# Altium project AfternoonCape_RevA1_TImux.PrjPCB
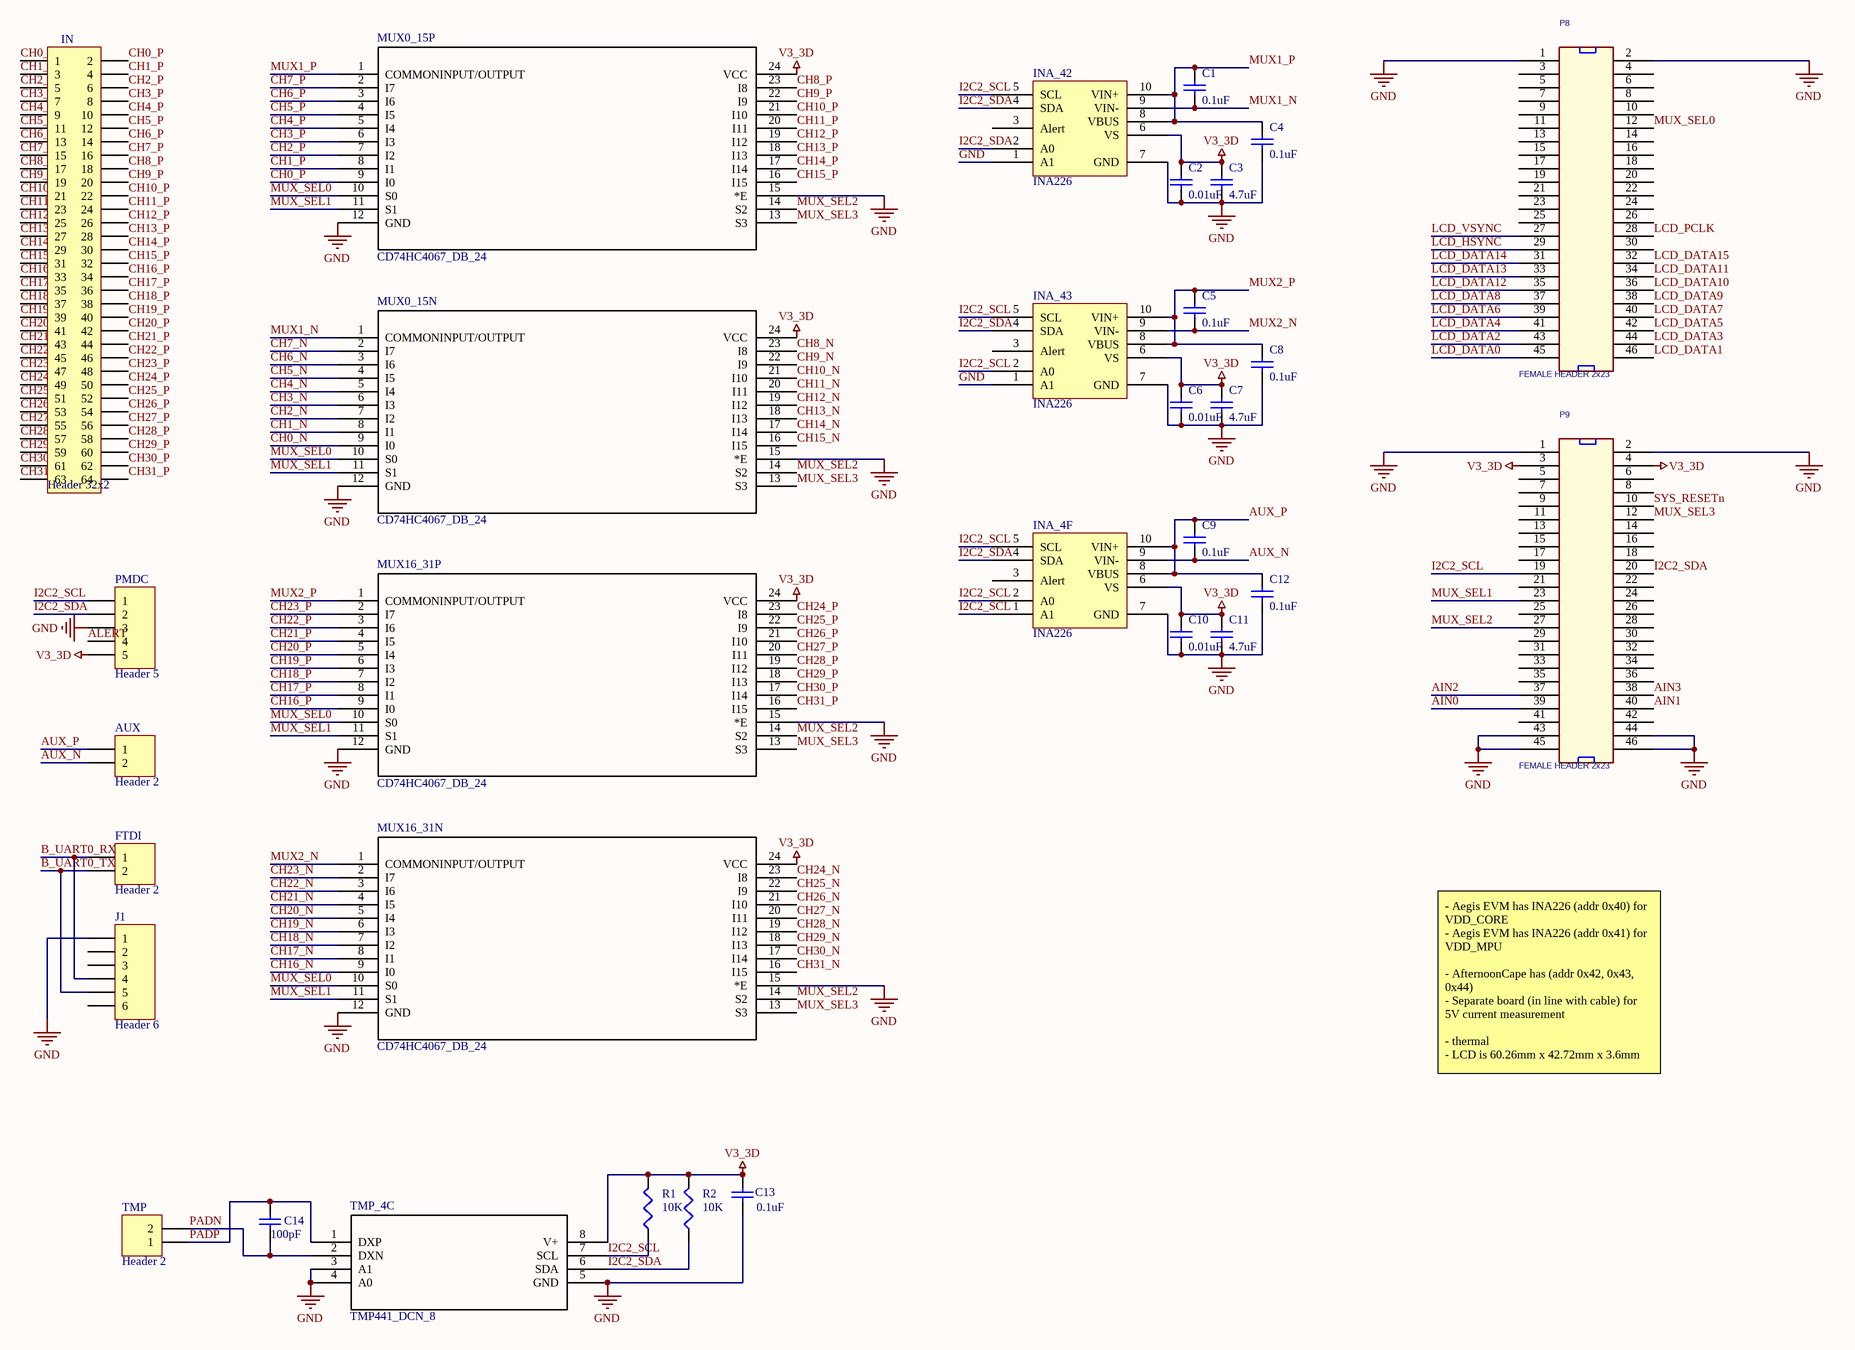
[diagram p0: AfternoonCape_RevA1_TImux.SchDoc]
1 sheet, 32 parts. Net scope: global (net labels, ports and power ports of the same name join across sheets).
Board file: AfternoonCape_RevA1_TImux.PcbDoc

## Sheet AfternoonCape_RevA1_TImux.SchDoc
size A2

### Parts
AUX  Header 2  [HDR1X2]
C1  value 0.1uF  [0402]  (hidden comment: Cap Semi)
C2  value 0.01uF  [0402]  (hidden comment: Cap Semi)
C3  value 4.7uF  [0402]  (hidden comment: Cap Semi)
C4  value 0.1uF  [0402]  (hidden comment: Cap Semi)
C5  value 0.1uF  [0402]  (hidden comment: Cap Semi)
C6  value 0.01uF  [0402]  (hidden comment: Cap Semi)
C7  value 4.7uF  [0402]  (hidden comment: Cap Semi)
C8  value 0.1uF  [0402]  (hidden comment: Cap Semi)
C9  value 0.1uF  [0402]  (hidden comment: Cap Semi)
C10  value 0.01uF  [0402]  (hidden comment: Cap Semi)
C11  value 4.7uF  [0402]  (hidden comment: Cap Semi)
C12  value 0.1uF  [0402]  (hidden comment: Cap Semi)
C13  value 0.1uF  [0402]  (hidden comment: Cap Semi)
C14  value 100pF  [0402]  (hidden comment: Cap Semi)
FTDI  Header 2  [HDR1X2]
IN  Header 32x2  [HDR2x32]
INA_4F  INA226  [DGS10]
INA_42  INA226  [DGS10]
INA_43  INA226  [DGS10]
J1  Header 6  [HDR1X6]
MUX0_15N  CD74HC4067_DB_24  [DB24]
MUX0_15P  CD74HC4067_DB_24  [DB24]
MUX16_31N  CD74HC4067_DB_24  [DB24]
MUX16_31P  CD74HC4067_DB_24  [DB24]
P8  FEMALE HEADER 2x23  [HEADER23X2]
P9  FEMALE HEADER 2x23  [HEADER23X2]
PMDC  Header 5  [HDR1X5]
R1  value 10K  [0402]  (hidden comment: Res3)
R2  value 10K  [0402]  (hidden comment: Res3)
TMP  Header 2  [HDR1X2]
TMP_4C  TMP441_DCN_8  [DCN8-L]

### Nets
GND: C2.1 C3.1 C4.1 C6.1 C7.1 C8.1 C10.1 C11.1 C12.1 C13.1 INA_4F.7(GND) INA_42.1(A1) INA_42.7(GND) INA_43.1(A1) INA_43.7(GND) J1.1 MUX0_15N.12(GND) MUX0_15N.15(*E) MUX0_15P.12(GND) MUX0_15P.15(*E) MUX16_31N.12(GND) MUX16_31N.15(*E) MUX16_31P.12(GND) MUX16_31P.15(*E) P8.1 P8.2 P9.1 P9.2 P9.43 P9.44 P9.45 P9.46 PMDC.3 TMP_4C.3(A1) TMP_4C.4(A0) TMP_4C.5(GND)
V3_3D: C2.2 C3.2 C6.2 C7.2 C10.2 C11.2 C13.2 INA_4F.6(VS) INA_42.6(VS) INA_43.6(VS) MUX0_15N.24(VCC) MUX0_15P.24(VCC) MUX16_31N.24(VCC) MUX16_31P.24(VCC) P9.3 P9.4 PMDC.5 R1.2 R2.2 TMP_4C.8(V+)
AIN0: P9.39
AIN1: P9.40
AIN2: P9.37
AIN3: P9.38
ALERT: PMDC.4
AUX_N: AUX.2 C9.1 INA_4F.9(VIN-)
AUX_P: AUX.1 C9.2 C12.2 INA_4F.8(VBUS) INA_4F.10(VIN+)
B_UART0_RX: FTDI.1 J1.4
B_UART0_TX: FTDI.2 J1.5
CH0_N: IN.1 MUX0_15N.9(I0)
CH0_P: IN.2 MUX0_15P.9(I0)
CH1_N: IN.3 MUX0_15N.8(I1)
CH1_P: IN.4 MUX0_15P.8(I1)
CH2_N: IN.5 MUX0_15N.7(I2)
CH2_P: IN.6 MUX0_15P.7(I2)
CH3_N: IN.7 MUX0_15N.6(I3)
CH3_P: IN.8 MUX0_15P.6(I3)
CH4_N: IN.9 MUX0_15N.5(I4)
CH4_P: IN.10 MUX0_15P.5(I4)
CH5_N: IN.11 MUX0_15N.4(I5)
CH5_P: IN.12 MUX0_15P.4(I5)
CH6_N: IN.13 MUX0_15N.3(I6)
CH6_P: IN.14 MUX0_15P.3(I6)
CH7_N: IN.15 MUX0_15N.2(I7)
CH7_P: IN.16 MUX0_15P.2(I7)
CH8_N: IN.17 MUX0_15N.23(I8)
CH8_P: IN.18 MUX0_15P.23(I8)
CH9_N: IN.19 MUX0_15N.22(I9)
CH9_P: IN.20 MUX0_15P.22(I9)
CH10_N: IN.21 MUX0_15N.21(I10)
CH10_P: IN.22 MUX0_15P.21(I10)
CH11_N: IN.23 MUX0_15N.20(I11)
CH11_P: IN.24 MUX0_15P.20(I11)
CH12_N: IN.25 MUX0_15N.19(I12)
CH12_P: IN.26 MUX0_15P.19(I12)
CH13_N: IN.27 MUX0_15N.18(I13)
CH13_P: IN.28 MUX0_15P.18(I13)
CH14_N: IN.29 MUX0_15N.17(I14)
CH14_P: IN.30 MUX0_15P.17(I14)
CH15_N: IN.31 MUX0_15N.16(I15)
CH15_P: IN.32 MUX0_15P.16(I15)
CH16_N: IN.33 MUX16_31N.9(I0)
CH16_P: IN.34 MUX16_31P.9(I0)
CH17_N: IN.35 MUX16_31N.8(I1)
CH17_P: IN.36 MUX16_31P.8(I1)
CH18_N: IN.37 MUX16_31N.7(I2)
CH18_P: IN.38 MUX16_31P.7(I2)
CH19_N: IN.39 MUX16_31N.6(I3)
CH19_P: IN.40 MUX16_31P.6(I3)
CH20_N: IN.41 MUX16_31N.5(I4)
CH20_P: IN.42 MUX16_31P.5(I4)
CH21_N: IN.43 MUX16_31N.4(I5)
CH21_P: IN.44 MUX16_31P.4(I5)
CH22_N: IN.45 MUX16_31N.3(I6)
CH22_P: IN.46 MUX16_31P.3(I6)
CH23_N: IN.47 MUX16_31N.2(I7)
CH23_P: IN.48 MUX16_31P.2(I7)
CH24_N: IN.49 MUX16_31N.23(I8)
CH24_P: IN.50 MUX16_31P.23(I8)
CH25_N: IN.51 MUX16_31N.22(I9)
CH25_P: IN.52 MUX16_31P.22(I9)
CH26_N: IN.53 MUX16_31N.21(I10)
CH26_P: IN.54 MUX16_31P.21(I10)
CH27_N: IN.55 MUX16_31N.20(I11)
CH27_P: IN.56 MUX16_31P.20(I11)
CH28_N: IN.57 MUX16_31N.19(I12)
CH28_P: IN.58 MUX16_31P.19(I12)
CH29_N: IN.59 MUX16_31N.18(I13)
CH29_P: IN.60 MUX16_31P.18(I13)
CH30_N: IN.61 MUX16_31N.17(I14)
CH30_P: IN.62 MUX16_31P.17(I14)
CH31_N: IN.63 MUX16_31N.16(I15)
CH31_P: IN.64 MUX16_31P.16(I15)
I2C2_SCL: INA_4F.1(A1) INA_4F.2(A0) INA_4F.5(SCL) INA_42.5(SCL) INA_43.2(A0) INA_43.5(SCL) P9.19 PMDC.1 R1.1 TMP_4C.7(SCL)
I2C2_SDA: INA_4F.4(SDA) INA_42.2(A0) INA_42.4(SDA) INA_43.4(SDA) P9.20 PMDC.2 R2.1 TMP_4C.6(SDA)
LCD_DATA0: P8.45
LCD_DATA1: P8.46
LCD_DATA2: P8.43
LCD_DATA3: P8.44
LCD_DATA4: P8.41
LCD_DATA5: P8.42
LCD_DATA6: P8.39
LCD_DATA7: P8.40
LCD_DATA8: P8.37
LCD_DATA9: P8.38
LCD_DATA10: P8.36
LCD_DATA11: P8.34
LCD_DATA12: P8.35
LCD_DATA13: P8.33
LCD_DATA14: P8.31
LCD_DATA15: P8.32
LCD_HSYNC: P8.29
LCD_PCLK: P8.28
LCD_VSYNC: P8.27
MUX1_N: C1.1 INA_42.9(VIN-) MUX0_15N.1(COMMONINPUT/OUTPUT)
MUX1_P: C1.2 C4.2 INA_42.8(VBUS) INA_42.10(VIN+) MUX0_15P.1(COMMONINPUT/OUTPUT)
MUX2_N: C5.1 INA_43.9(VIN-) MUX16_31N.1(COMMONINPUT/OUTPUT)
MUX2_P: C5.2 C8.2 INA_43.8(VBUS) INA_43.10(VIN+) MUX16_31P.1(COMMONINPUT/OUTPUT)
MUX_SEL0: MUX0_15N.10(S0) MUX0_15P.10(S0) MUX16_31N.10(S0) MUX16_31P.10(S0) P8.12
MUX_SEL1: MUX0_15N.11(S1) MUX0_15P.11(S1) MUX16_31N.11(S1) MUX16_31P.11(S1) P9.23
MUX_SEL2: MUX0_15N.14(S2) MUX0_15P.14(S2) MUX16_31N.14(S2) MUX16_31P.14(S2) P9.27
MUX_SEL3: MUX0_15N.13(S3) MUX0_15P.13(S3) MUX16_31N.13(S3) MUX16_31P.13(S3) P9.12
PADN: C14.1 TMP.2 TMP_4C.2(DXN)
PADP: C14.2 TMP.1 TMP_4C.1(DXP)
SYS_RESETn: P9.10

Not connected (* = marked no-connect by the designer): INA_4F 3(Alert); INA_42 3(Alert); INA_43 3(Alert); J1 2 3 6; P8 3(2) 4(27) 5(3) 6(28) 7(4) 8(29) 9(5) 10(30) 11(6) 13(7) 14(32) 15(8) 16(33) 17(9) 18(34) 19(10) 20(35) 21(11) 22(36) 23(12) 24(37) 25(13) 26(38) 30(40); P9 5(3) 6(28) 7(4) 8(29) 9(5) 11(6) 13(7) 14(32) 15(8) 16(33) 17(9) 18(34) 21(11) 22(36) 24(37) 25(13) 26(38) 28(39) 29(15) 30(40) 31(16) 32(41) 33(17) 34(42) 35(18) 36(43) 41(21) 42(46)

### Notes on the sheet
- - Aegis EVM has INA226 (addr 0x40) for VDD_CORE
  - Aegis EVM has INA226 (addr 0x41) for VDD_MPU
  - AfternoonCape has (addr 0x42, 0x43, 0x44)
  - Separate board (in line with cable) for 5V current measurement
  - thermal
  - LCD is 60.26mm x 42.72mm x 3.6mm
- Title
- Size:
- Date:
- File:
- A2
- Number:
- Time:
- Revision:
- Sheet
- of

### Library data of the parts
AUX FTDI TMP = Header 2: Header, 2-Pin; LatestRevisionDate: 17-Jul-2002; LatestRevisionNote: Re-released for DXP Platform.; Publisher: Altium Limited
C1-C14 = Cap Semi: Capacitor (Semiconductor SIM Model); Published: 8-Jun-2000; LatestRevisionDate: 29-May-2009; LatestRevisionNote: IPC-7351 Footprint Added.; PackageReference: C1206; Publisher: Altium Limited; PackageDescription: Chip Capacitor
IN = Header 32x2: Header, 32-Pin, Dual row
J1 = Header 6: 6-pin female header, long legs for FTDI-USB cable; LatestRevisionDate: 17-Jul-2002; LatestRevisionNote: Re-released for DXP Platform.; Publisher: Altium Limited
MUX0_15N MUX0_15P MUX16_31N MUX16_31P = CD74HC4067_DB_24: Imported; Manufacturer: Texas Instruments; INDUSTRY_STD_PKG_TYPE: SSOP; FAMILY_NAME: ANALOG SWITCH/MULTIPLEXER(less than or equal to 5V); PIN_COUNT: 24; PACKAGE_DESIGNATOR: DB; Datasheet URL: http://www.ti.com/lit/gpn/CD74HC4067; GENERIC_PART_NUMBER: CD74HC4067; RefDes: RefDes; Type: DEV; Value: Value
P8 P9 = HDR_46_F_2_0.1_0.1: CONN HEADER FMAL 46PS.1" DL GOLD; Manufacturer: Sullins Connector Solutions; Manufacturer Part Number: PPPC232LFBN-RC; Number of Positions: 46; Number of Positions Loaded: All; Pitch: 0.100" (2.54mm); Supplier 1: Digi-Key; Supplier Part Number 1: S7126-ND; RoHS: RoHS Compliant; Category: Connectors, Interconnects; Stock 1: 750; Pricing 1: 1=2.75, 10=2.325, 25=2.2196, 50=2.0084, 100=1.7969, 250=1.58552, 500=1.4798, 1000=1.3741, 2500=1.32125 (USD); Connector Type: Header; Contact Type: Female Socket; Number of Rows: 2; Row Spacing: 0.100" (2.54mm); Mounting Type: Through Hole; Termination: Solder; Fastening Type: -; Features: -; Contact Finish: Gold; Contact Finish Thickness: Flash; Color: Black; Packaging: Bulk; ComponentLink1URL: http://www.sullinscorp.com/drawings/78_P(N)PxCxxxLFBN-RC,_10492-G.pdf; ComponentLink1Description: http://www.sullinscorp.com/drawings/78_P(N)PxCxxxLFBN-RC,_10492-G.pdf
PMDC = Header 5: Header, 5-Pin; LatestRevisionDate: 17-Jul-2002; LatestRevisionNote: Re-released for DXP Platform.; Publisher: Altium Limited
R1 R2 = Res3: Resistor; Published: 8-Jun-2000; LatestRevisionDate: 29-May-2009; LatestRevisionNote: IPC-7351 Footprint Added.; PackageReference: J1-0603; Publisher: Altium Limited; PackageDescription: Chip Resistor
TMP_4C = TMP441_DCN_8: Imported; GENERIC_PART_NUMBER: TMP441; Vendor: Texas Instruments; PACKAGE_DESIGNATOR: DCN; PIN_COUNT: 8; FAMILY_NAME: TEMPERATURE SENSOR; INDUSTRY_STD_PKG_TYPE: SOT-23; Manufacturer_Part_Number: tmp441_dcn_8; Datasheet URL: http://www.ti.com/lit/gpn/TMP441; Manufacturer: Texas Instruments; RefDes: RefDes; Type: DEV; Value: Value